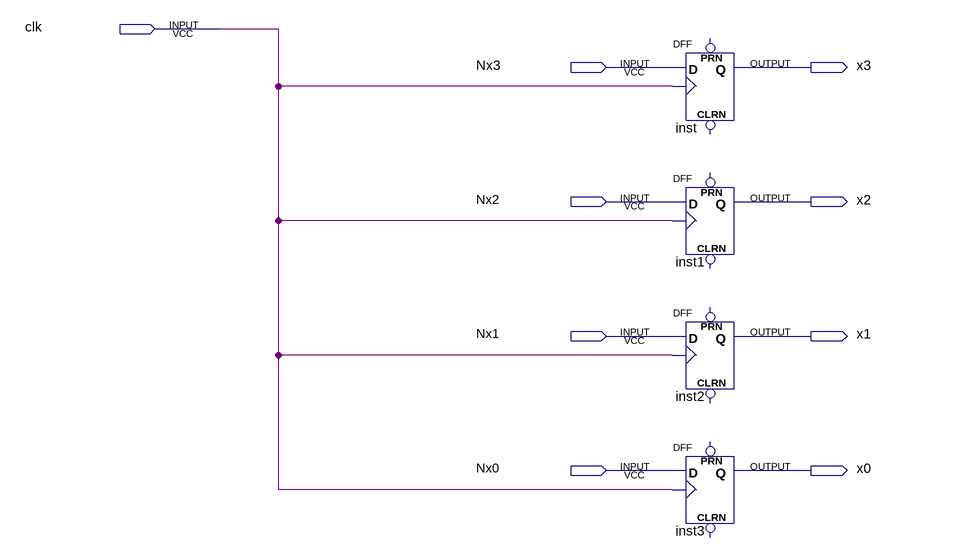
[diagram p0: schematic sheet]
// Quartus schematic State.bdf as structural Verilog: 4 symbols, 9 pins
module State (
  input  clk,
  input  Nx3,
  input  Nx2,
  input  Nx1,
  input  Nx0,
  output x3,
  output x2,
  output x1,
  output x0
);

  DFF inst (.CLK(clk), .D(Nx3), .Q(x3));  // open: CLRN, PRN
  DFF inst1 (.CLK(clk), .D(Nx2), .Q(x2));  // open: CLRN, PRN
  DFF inst2 (.CLK(clk), .D(Nx1), .Q(x1));  // open: CLRN, PRN
  DFF inst3 (.CLK(clk), .D(Nx0), .Q(x0));  // open: CLRN, PRN
endmodule
